# Altium project H743-Feedback.PrjPcb (part 2 of 3)

## Sheet Feedback.SchDoc: Feedback
size Tabloid; DocumentNumber: FB-001; Revision: A; SheetNumber: 3; SheetTotal: 5
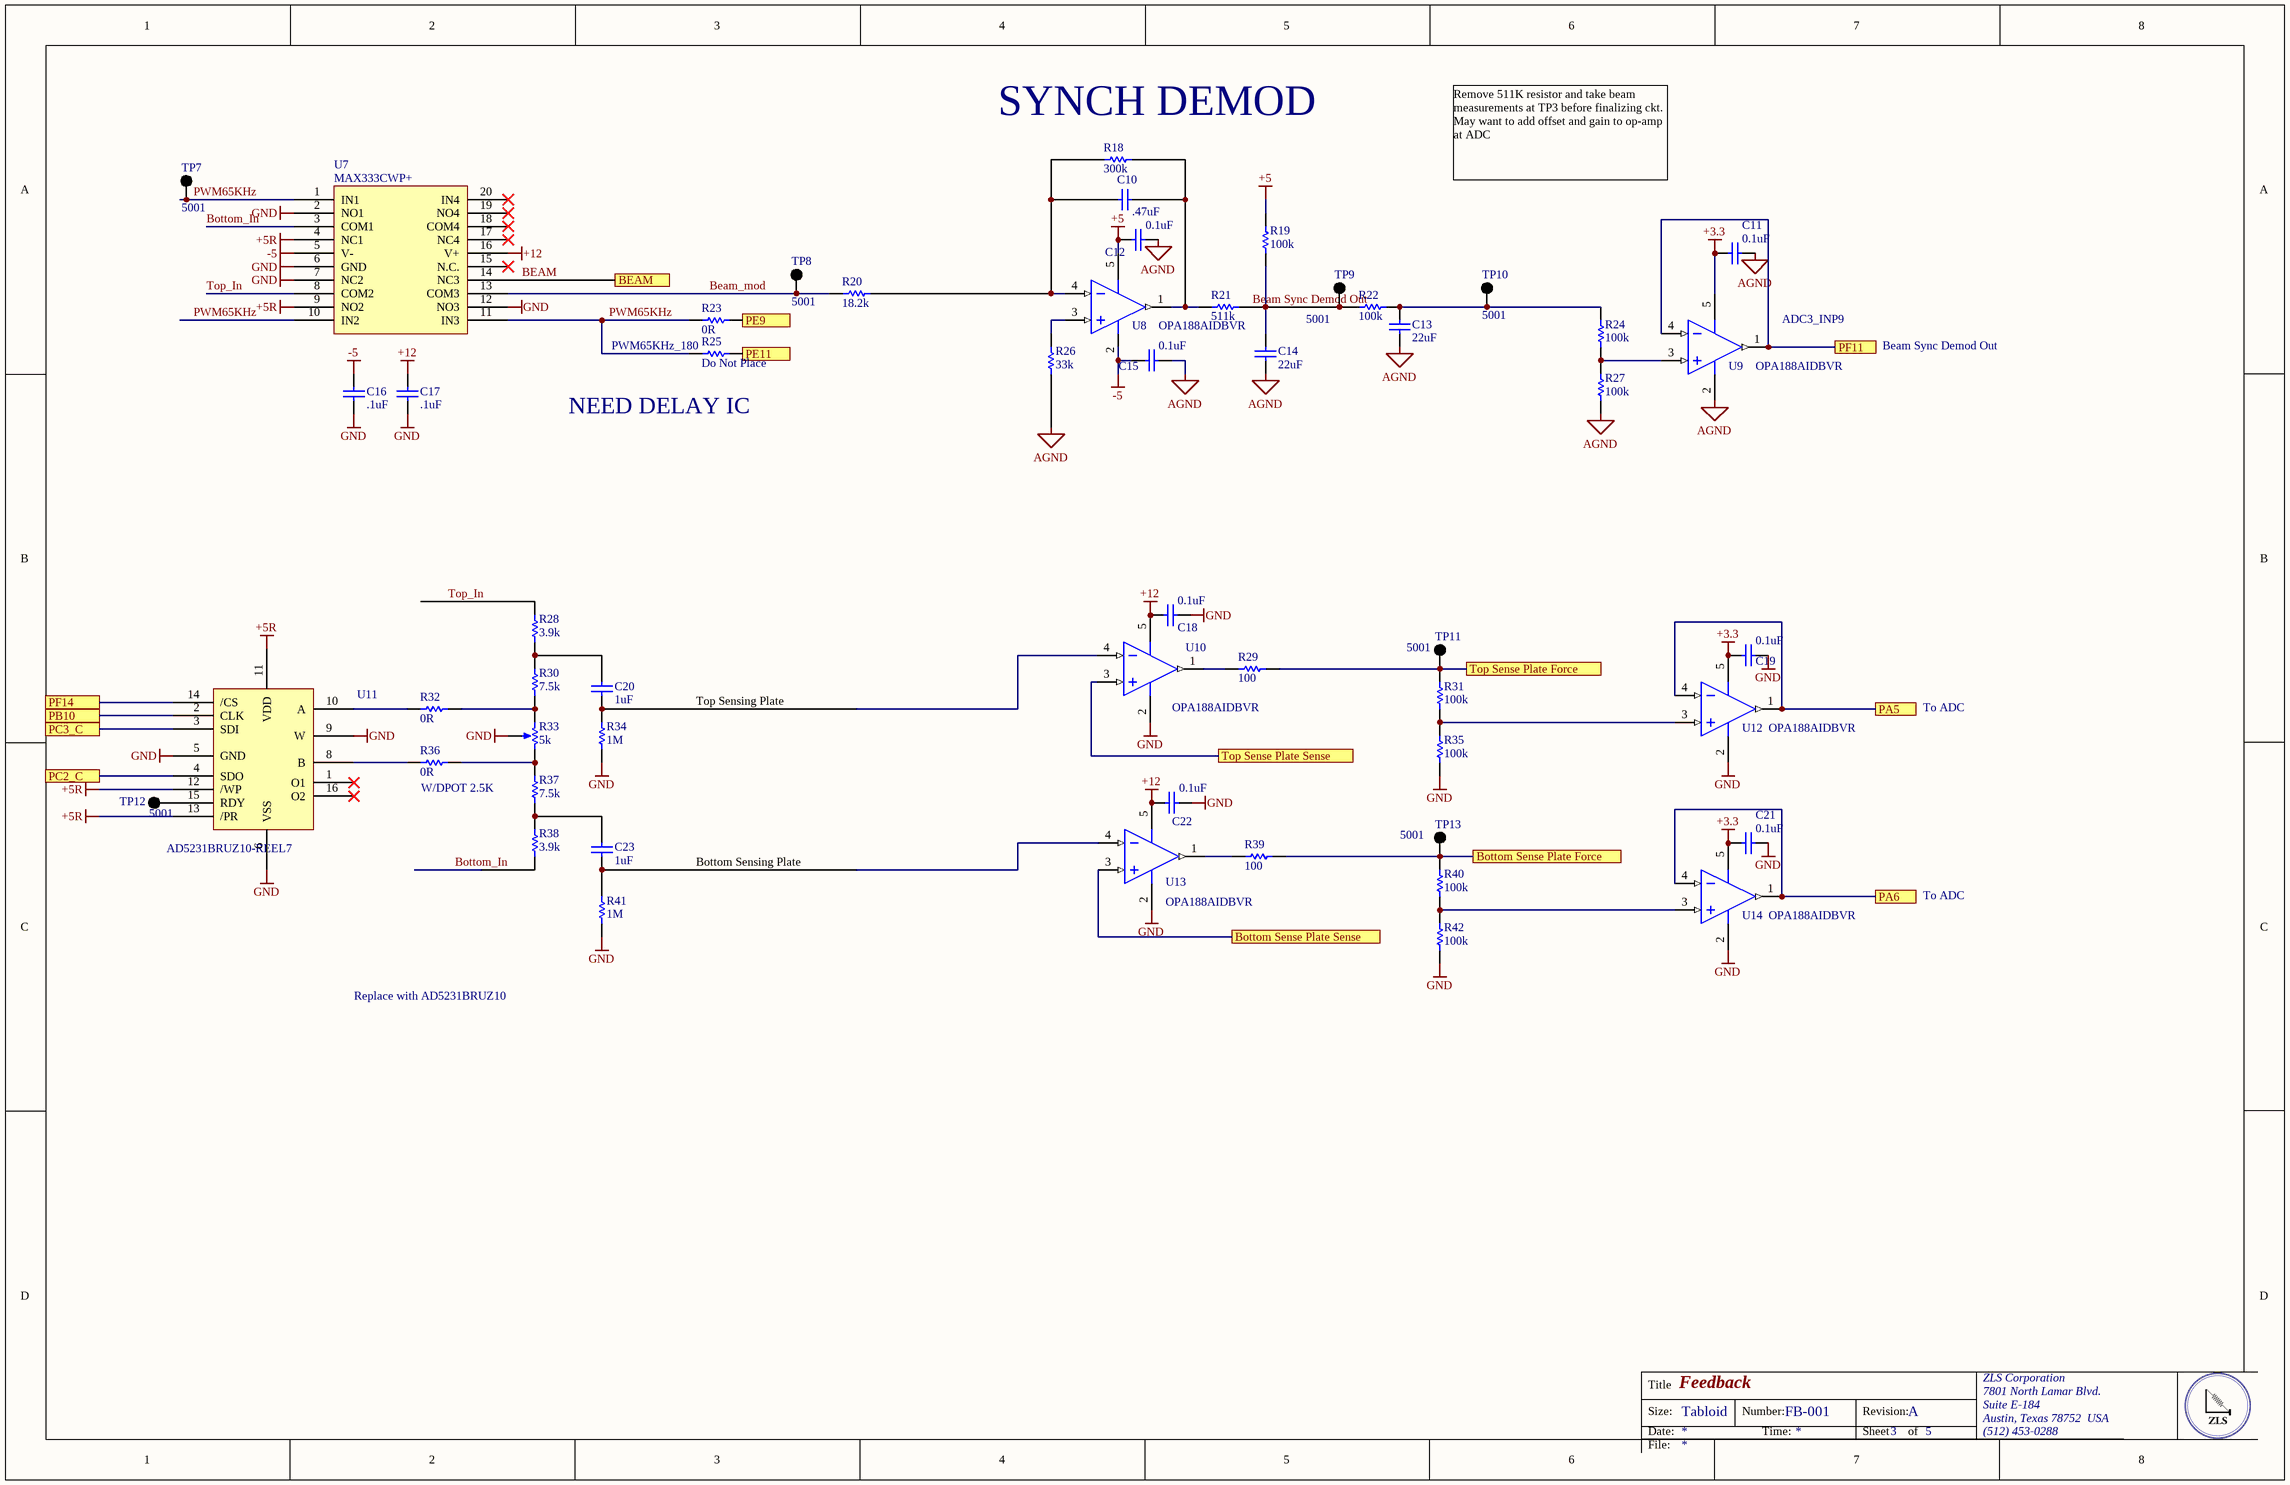
[diagram p2: Feedback.SchDoc]

### Parts
C10  .47uF  [CAPC0805(2012)75_L]
C11  0.1uF  [CAPC0402(1005)60_L]
C12  0.1uF  [CAPC0402(1005)60_L]
C13  22uF  [CAPC0805(2012)75_L]
C14  22uF  [CAPC0805(2012)75_L]
C15  0.1uF  [CAPC0402(1005)60_L]
C16  .1uF  [CAPC0805(2012)75_M]
C17  .1uF  [CAPC0805(2012)75_M]
C18  0.1uF  [CAPC0402(1005)60_L]
C19  0.1uF  [CAPC0402(1005)60_L]
C20  1uF  [CAPC0402(1005)60_L]
C21  0.1uF  [CAPC0402(1005)60_L]
C22  0.1uF  [CAPC0402(1005)60_L]
C23  1uF  [CAPC0402(1005)60_L]
R18  300k  [RESC1005X40X25LL05T05]
R19  100k  [RESC0402(1005)_M]
R20  18.2k  [RESC1005X40X25NL05T05]
R21  511k  [RESC1005X40X25ML05T05]
R22  100k  [RESC0402(1005)_M]
R23  0R  [RESC1005X40X25NL05T10]
R24  100k  [RESC0402(1005)_M]
R25  Do Not Place  [RESC1005X40X25NL05T10]
R26  33k  [RESC0402(1005)_N]
R27  100k  [RESC0402(1005)_M]
R28  3.9k  [RESC1005X40X25NL05T05]
R29  100  [RESC0402(1005)_N]
R30  7.5k  [RESC1005X40X25LL05T05]
R31  100k  [RESC0402(1005)_M]
R32  0R  [RESC1005X40X25NL05T10]
R33  Resistance (Ohms): 5k  [Trimmer 2.54]  (hidden comment: Do Not Place)
R34  1M  [RESC1005X40X25NL05T05]
R35  100k  [RESC0402(1005)_M]
R36  0R  [RESC1005X40X25NL05T10]
R37  7.5k  [RESC1005X40X25LL05T05]
R38  3.9k  [RESC1005X40X25NL05T05]
R39  100  [RESC0402(1005)_N]
R40  100k  [RESC0402(1005)_M]
R41  1M  [RESC1005X40X25NL05T05]
R42  100k  [RESC0402(1005)_M]
TP7  5001  [KSTN-5001]
TP8  5001  [KSTN-5001]
TP9  5001  [KSTN-5001]
TP10  5001  [KSTN-5001]
TP11  5001  [KSTN-5001]
TP12  5001  [KSTN-5001]
TP13  5001  [KSTN-5001]
U7  MAX333CWP+  [TSOP65P640X90-20N]
U8  OPA188AIDBVR  [DBV0005A_M]
U9  OPA188AIDBVR  [DBV0005A_M]
U10  OPA188AIDBVR  [DBV0005A_M]
U11  AD5231BRUZ10-REEL7  [AD5231BRUZ10]
U12  OPA188AIDBVR  [DBV0005A_M]
U13  OPA188AIDBVR  [DBV0005A_M]
U14  OPA188AIDBVR  [DBV0005A_M]

### Ports
BEAM, Bottom Sense Plate Force, Bottom Sense Plate Sense, PA5, PA6, PB10, PC2_C, PC3_C, PE9, PE11, PF11, PF14, Top Sense Plate Force, Top Sense Plate Sense

### Nets
+3.3: C11.2 C19.2 C21.2 U9.5(V+) U12.5(V+) U14.5(V+)
+5: C12.2 R19.2 U8.5(V+)
+5R: U7.4(NC1) U7.9(NO2) U11.11(VDD) U11.12(/WP) U11.13(/PR)
+12: C17.2 C18.2 C22.2 U7.16(V+) U10.5(V+) U13.5(V+)
-5: C15.2 C16.2 U7.5(V-) U8.2(V-)
AGND: C11.1 C12.1 C13.1 C14.1 C15.1 R26.1 R27.1 U9.2(V-)
GND: C16.1 C17.1 C18.1 C19.1 C21.1 C22.1 R33.2(b) R34.1 R35.1 R41.1 R42.1 U7.2(NO1) U7.6(GND) U7.7(NC2) U7.12(NO3) U10.2(V-) U11.5(GND) U11.6(VSS) U11.9(W) U12.2(V-) U13.2(V-) U14.2(V-)
BEAM: U7.14(NC3) ; port BEAM
Beam Sync Demod Out: C14.2 R19.1 R21.2 R22.2 TP9.1
Beam_mod: R20.1 TP8.1 U7.13(COM3)
Bottom Sense Plate Force: R39.2 R40.2 TP13.1 ; port Bottom Sense Plate Force
Bottom Sense Plate Sense: U13.3(IN+) ; port Bottom Sense Plate Sense
Bottom_In: R38.1 U7.3(COM1)
PA5: U12.1(OUT) U12.4(IN-) ; port PA5
PA6: U14.1(OUT) U14.4(IN-) ; port PA6
PB10: U11.2(CLK) ; port PB10
PC2_C: U11.4(SDO) ; port PC2_C
PC3_C: U11.3(SDI) ; port PC3_C
PE9: R23.2 ; port PE9
PE11: R25.2 ; port PE11
PF11: U9.1(OUT) U9.4(IN-) ; port PF11
PF14: U11.14(/CS) ; port PF14
PWM65KHz: R23.1 R25.1 TP7.1 U7.1(IN1) U7.10(IN2) U7.11(IN3)
Top Sense Plate Force: R29.2 R31.2 TP11.1 ; port Top Sense Plate Force
Top Sense Plate Sense: U10.3(IN+) ; port Top Sense Plate Sense
Top_In: R28.2 U7.8(COM2)
NetC10_1: C10.1 R18.1 R20.2 U8.4(IN-)
NetC10_2: C10.2 R18.2 R21.1 U8.1(OUT)
NetC13_2: C13.2 R22.1 R24.2 TP10.1
NetC20_1: C20.1 R34.2 U10.4(IN-)
NetC20_2: C20.2 R28.1 R30.2
NetC23_1: C23.1 R41.2 U13.4(IN-)
NetC23_2: C23.2 R37.1 R38.2
NetR24_1: R24.1 R27.2 U9.3(IN+)
NetR26_2: R26.2 U8.3(IN+)
NetR29_1: R29.1 U10.1(OUT)
NetR30_1: R30.1 R32.2 R33.1(a)
NetR31_1: R31.1 R35.2 U12.3(IN+)
NetR32_1: R32.1 U11.10(A)
NetR33_3: R33.3(c) R36.2 R37.2
NetR36_1: R36.1 U11.8(B)
NetR39_1: R39.1 U13.1(OUT)
NetR40_1: R40.1 R42.2 U14.3(IN+)
NetTP12_1: TP12.1 U11.15(RDY)

Not connected (* = marked no-connect by the designer): U7 15(N.C.)* 17(NC4)* 18(COM4)* 19(NO4)* 20(IN4)*; U11 1(O1)* 16(O2)*

### Notes on the sheet
- (near R18) SYNCH DEMOD
- Remove 511K resistor and take beam measurements at TP3 before finalizing ckt.
  May want to add offset and gain to op-amp at ADC
- PWM65KHz_180
- (near U9) ADC3_INP9
- Beam Sync Demod Out
- (near R25) NEED DELAY IC
- Top Sensing Plate
- To ADC
- (near R36) W/DPOT 2.5K
- Bottom Sensing Plate
- Replace with AD5231BRUZ10
- Title
- Size:
- Date:
- Tabloid
- Number:
- Time:
- Revision:
- Sheet
- of
- ZLS Corporation
- 7801 North Lamar Blvd.
- Suite E-184
- Austin, Texas 78752  USA
- (512) 453-0288
- File:

### Library data of the parts
C10 = CMP-1036-02117-1: 0.47µF ±10% 16V Ceramic Capacitor X7R 0805 (2012 Metric); Manufacturer: Samsung; Manufacturer Part Number: CL21B474KOFNNNE; Capacitance: 470nF; Supplier 1: Future Electronics; Supplier Part Number 1: CL21B474KOFNNNE-CUTT; Stock 1: 1990; Pricing 1: 1=0.0399, 50=0.0138, 100=0.0114, 250=0.0089, 500=0.0074 (USD); Mount: Surface Mount; Case/Package: 0805; Case Code (Metric): 2012; Case Code (Imperial): 0805; Contact Plating: Tin; Min Operating Temperature: -55°C; Max Operating Temperature: 125°C; Tolerance: 10%; Dielectric: X7R; Packaging: Tape and Reel; Voltage Rating: 16V; Package Quantity: 2000; Voltage Rating (DC): 16V; Length: 2mm; Height: 1.25mm; Width: 0.049inch; Thickness: 0.053inch; Depth: 1.25mm; Radiation Hardening: No; Lead Free: Lead Free; ComponentLink1URL: https://www.verical.com/server-webapp/html/getDatasheet?partID=482152&src-supplier=Verical; ComponentLink1Description: https://www.verical.com/server-webapp/html/getDatasheet?partID=482152&src-supplier=Verical
C11 C12 C15 C18 C19 C21 C22 = CMP-1034-00252-1: CAP CER 0.1UF 10V X7R 0402; Manufacturer: Murata Electronics North America; Manufacturer Part Number: GRM155R71A104KA01D; Tolerance: ±10%; Supplier 1: Digi-Key; Supplier Part Number 1: 490-6321-1-ND; RoHS: RoHS Compliant; Category: Capacitors; Stock 1: 2920395; Pricing 1: 1=0.1, 10=0.014, 100=0.0063, 500=0.00446, 1000=0.00351, 2500=0.00319, 5000=0.00293 (USD); Packaging: Cut Tape (CT); Part Status: Active; Voltage - Rated: 10V; Temperature Coefficient: X7R; Operating Temperature: -55°C ~ 125°C; Features: -; Ratings: -; Applications: General Purpose; Mounting Type: Surface Mount, MLCC; Package / Case: 0402 (1005 Metric); Size / Dimension: 0.039" L x 0.020" W (1.00mm x 0.50mm); Height - Seated (Max): -; Thickness (Max): 0.022" (0.55mm); Lead Spacing: -; ComponentLink1URL: http://www.murata.com/~/media/webrenewal/support/library/catalog/products/capacitor/mlcc/c02e.ashx?la=en-us; ComponentLink1Description: http://www.murata.com/~/media/webrenewal/support/library/catalog/products/capacitor/mlcc/c02e.ashx?la=en-us
C13 C14 = CMP-1036-02117-1: 22µF ±20% 16V Ceramic Capacitor X5R 0805 (2012 Metric); Manufacturer: Samsung; Manufacturer Part Number: CL21A226MOCLRNC; Supplier 1: Arrow; Supplier Part Number 1: CL21A226MOCLRNC; Stock 1: 62995; Pricing 1: 1=0.3133, 10=0.2183, 25=0.2161, 100=0.1168, 250=0.1155, 500=0.0858, 1000=0.0716, 3000=0.0709, 6000=0.0594, 15000=0.0527, 30000=0.0522 (USD); Mount: Surface Mount; Case/Package: 0805; Case Code (Metric): 2012; Case Code (Imperial): 0805; Min Operating Temperature: -55°C; Max Operating Temperature: 85°C; Packaging: Tape and Reel; Capacitance: 22uF; Voltage Rating: 16V; Tolerance: 20%; Length: 0.079inch; Width: 0.049inch; Thickness: 0.037inch; ComponentLink1URL: http://www.samsungsem.com/kr/support/product-search/mlcc/CL21A226MOCLRNC.jsp?src-supplier=Digi-Key; ComponentLink1Description: http://www.samsungsem.com/kr/support/product-search/mlcc/CL21A226MOCLRNC.jsp?src-supplier=Digi-Key
C16 C17 = CMP-1036-01414-1: 0.1µF ±10% 16V Ceramic Capacitor X7R 0805 (2012 Metric); Manufacturer: Yageo; Manufacturer Part Number: CC0805KRX7R7BB104; Capacitance: 100nF; Insulation Resistance: 100GR; Supplier 1: Future Electronics; Supplier Part Number 1: CC0805KRX7R7BB104-CUTT; Stock 1: 160; Pricing 1: 1=0.0364, 100=0.0181, 250=0.0158, 500=0.0142, 1500=0.012 (USD); Mount: Surface Mount; Case/Package: 0805; Number of Pins: 2; Case Code (Metric): 2012; Case Code (Imperial): 0805; Min Operating Temperature: -55°C; Max Operating Temperature: 125°C; Tolerance: 10%; Dielectric: X7R; Voltage Rating: 16V; Voltage Rating (DC): 16V; Packaging: Tape and Reel; Package Quantity: 1; Termination: SMD/SMT; Composition: Ceramic; Voltage: 16V; Length: 2mm; Height: 0.85mm; Depth: 1.25mm; Width: 0.049inch; Thickness: 0.033inch; Radiation Hardening: No; REACH SVHC: No SVHC; Lead Free: Lead Free; Halogen Free: Halogen Free; ComponentLink1URL: http://www.farnell.com/datasheets/1784427.pdf?src-supplier=Element14; ComponentLink1Description: http://www.farnell.com/datasheets/1784427.pdf?src-supplier=Element14; ComponentLink2URL: https://www.verical.com/server-webapp/html/getDatasheet?partID=314877&src-supplier=Verical; ComponentLink2Description: https://www.verical.com/server-webapp/html/getDatasheet?partID=314877&src-supplier=Verical; ComponentLink3URL: http://www.yageo.com/documents/recent/UPY-GPHC_X7R_6.3V-to-50V_18.pdf?src-supplier=Digi-Key; ComponentLink3Description: http://www.yageo.com/documents/recent/UPY-GPHC_X7R_6.3V-to-50V_18.pdf?src-supplier=Digi-Key; ComponentLink4URL: http://www.yageo.com/documents/recent/UPY-GPHC_X7R_6.3V-to-50V_8.pdf?src-supplier=Avnet; ComponentLink4Description: http://www.yageo.com/documents/recent/UPY-GPHC_X7R_6.3V-to-50V_8.pdf?src-supplier=Avnet; ComponentLink5URL: http://www.yageo.com/documents/recent/UPY-GPHC_X7R_6.3V-to-50V_8.pdf?src-supplier=Avnet+Europe; ComponentLink5Description: http://www.yageo.com/documents/recent/UPY-GPHC_X7R_6.3V-to-50V_8.pdf?src-supplier=Avnet+Europe; ComponentLink6URL: http://www.farnell.com/datasheets/1489800.pdf?src-supplier=Element14; ComponentLink6Description: http://www.farnell.com/datasheets/1489800.pdf?src-supplier=Element14
C20 C23 = CMP-1034-00252-1: 1µF ±10% 16V Ceramic Capacitor X5R 0402 (1005 Metric); Manufacturer: Samsung; Manufacturer Part Number: CL05A105KO5NNNC; Supplier 1: Future Electronics; Supplier Part Number 1: CL05A105KO5NNNC-CUTT; Stock 1: 8167; Pricing 1: 1=0.0074, 500=0.0064, 1500=0.0062, 2500=0.0061, 5000=0.006 (USD); Mount: Surface Mount; Case/Package: 0402; Case Code (Metric): 1005; Case Code (Imperial): 0402; Contact Plating: Tin; Min Operating Temperature: -55°C; Max Operating Temperature: 85°C; Tolerance: 10%; Capacitance: 1uF; Dielectric: X5R; Packaging: Tape and Reel; Package Quantity: 1; Voltage Rating: 16V; Voltage: 16V; Length: 1mm; Height: 0.5mm; Width: 0.02inch; Thickness: 0.022inch; Depth: 0.5mm; Radiation Hardening: No; ComponentLink1URL: http://www1.futureelectronics.com/doc/SAMSUNG/CL05A105KO5NNNC.pdf?src-supplier=Future+Electronics; ComponentLink1Description: http://www1.futureelectronics.com/doc/SAMSUNG/CL05A105KO5NNNC.pdf?src-supplier=Future+Electronics; ComponentLink2URL: https://www.verical.com/server-webapp/html/getDatasheet?partID=355272&src-supplier=Verical; ComponentLink2Description: https://www.verical.com/server-webapp/html/getDatasheet?partID=355272&src-supplier=Verical
R18 = CMP-2002-08495-1: RES SMD 300K OHM 1% 1/16W 0402; Manufacturer: Vishay Dale; Part Number: CRCW0402300KFKED; Resistance: 300kR; Temperature Coefficient: 100ppm/°C; Power Rating: 63mW; Voltage Rating: 50V; Supplier 1: Digi-Key; Supplier Part Number 1: 541-300KLCT-ND; Manufacturer Part Number: CRCW0402300KFKED; Stock 1: 11486; Pricing 1: 1=0.10000, 10=0.03800, 100=0.01540, 1000=0.00690, 2500=0.00599, 5000=0.00495 (USD); RoHS: Yes; Mount: Surface Mount; Case/Package: 0402; Number of Pins: 2; Weight: 2.3E-05oz; Case Code (Metric): 1005; Case Code (Imperial): 0402; Contact Plating: Tin; Min Operating Temperature: -55°C; Max Operating Temperature: 155°C; Tolerance: 1%; Packaging: Tape and Reel; Composition: Thick Film; Package Quantity: 10; Termination: SMD/SMT; Voltage Rating (DC): 50V; Number of Terminations: 2; Max Power Dissipation: 63mW; Features: Automotive AEC-Q200; Military Standard: Not; Length: 1mm; Height: 0.35mm; Width: 0.02inch; Depth: 0.5mm; Radiation Hardening: No; Lead Free: Lead Free; REACH SVHC: Unknown; ComponentLink1URL: https://datasheet.ciiva.com/11810/0900766b80d98824-11810173.pdf?src-supplier=RSComponents; ComponentLink1Description: https://datasheet.ciiva.com/11810/0900766b80d98824-11810173.pdf?src-supplier=RSComponents; ComponentLink2URL: https://datasheet.ciiva.com/22675/1912744-22675557.pdf?src-supplier=Element14; ComponentLink2Description: https://datasheet.ciiva.com/22675/1912744-22675557.pdf?src-supplier=Element14; ComponentLink3URL: https://datasheet.ciiva.com/2463/dcrcwe3-2463577.pdf?src-supplier=Digi-Key; ComponentLink3Description: https://datasheet.ciiva.com/2463/dcrcwe3-2463577.pdf?src-supplier=Digi-Key; ComponentLink4URL: https://datasheet.ciiva.com/2463/dcrcwe3-2463578.pdf?src-supplier=Digi-Key; ComponentLink4Description: https://datasheet.ciiva.com/2463/dcrcwe3-2463578.pdf?src-supplier=Digi-Key; ComponentLink5URL: https://datasheet.ciiva.com/8948/dcrcwe3-8948938.pdf?src-supplier=Avnet; ComponentLink5Description: https://datasheet.ciiva.com/8948/dcrcwe3-8948938.pdf?src-supplier=Avnet; ComponentLink6URL: https://datasheet.ciiva.com/16886/dcrcwe3-16886218.pdf?src-supplier=Avnet+Europe; ComponentLink6Description: https://datasheet.ciiva.com/16886/dcrcwe3-16886218.pdf?src-supplier=Avnet+Europe; ComponentLink7URL: https://datasheet.ciiva.com/2463/dcrcwe3-2463579.pdf?src-supplier=Digi-Key; ComponentLink7Description: https://datasheet.ciiva.com/2463/dcrcwe3-2463579.pdf?src-supplier=Digi-Key; ComponentLink8URL: https://datasheet.ciiva.com/7674/1697337-7674011.pdf?src-supplier=Element14; ComponentLink8Description: https://datasheet.ciiva.com/7674/1697337-7674011.pdf?src-supplier=Element14; ComponentLink9URL: https://datasheet.ciiva.com/7674/1697337-7674012.pdf?src-supplier=Element14; ComponentLink9Description: https://datasheet.ciiva.com/7674/1697337-7674012.pdf?src-supplier=Element14; ComponentLink10URL: https://datasheet.ciiva.com/16396/dcrcwe3-16396924.pdf?src-supplier=Future+Electronics; ComponentLink10Description: https://datasheet.ciiva.com/16396/dcrcwe3-16396924.pdf?src-supplier=Future+Electronics; ComponentLink11URL: https://datasheet.ciiva.com/5551/dcrcwe3-109170-5551389.pdf?src-supplier=Mouser; ComponentLink11Description: https://datasheet.ciiva.com/5551/dcrcwe3-109170-5551389.pdf?src-supplier=Mouser; ComponentLink12URL: https://datasheet.ciiva.com/22708/1697337-22708046.pdf?src-supplier=Element14; ComponentLink12Description: https://datasheet.ciiva.com/22708/1697337-22708046.pdf?src-supplier=Element14
R19 R22 R24 R27 R31 R35 R40 R42 = CMP-1011-00940-1: 100k 0.063W 1% 0402 (1005 Metric)  SMD; Manufacturer: Panasonic; Manufacturer Part Number: ERJ-2RKF1003X; Resistance: 100kR; Power Rating: 100mW; Temperature Coefficient: 100ppm/°C; Voltage Rating: 50V; Supplier 1: Digi-Key; Supplier Part Number 1: P100KLCT-ND; Stock 1: 9533476; Pricing 1: 1=0.10000, 10=0.04500, 100=0.01830, 1000=0.00823, 2500=0.00715, 5000=0.00590 (USD); RoHS: Yes; Mount: Surface Mount; Case/Package: 0402; Number of Pins: 2; Case Code (Imperial): 0402; Case Code (Metric): 1005; Contact Plating: Tin; Min Operating Temperature: -55°C; Max Operating Temperature: 155°C; Tolerance: 1%; Packaging: Tape and Reel; Composition: Thick Film; Voltage Rating (DC): 50V; Termination: SMD/SMT; Military Standard: Not; Package Quantity: 1; Number of Terminations: 2; Max Power Dissipation: 100mW; Features: Automotive AEC-Q200; Length: 1mm; Height: 0.35mm; Width: 0.5mm; Depth: 0.5mm; Radiation Hardening: No; Lead Free: Lead Free; REACH SVHC: No SVHC; ComponentLink1URL: https://datasheet.ciiva.com/11821/0900766b80f80784-11821175.pdf?src-supplier=RSComponents; ComponentLink1Description: https://datasheet.ciiva.com/11821/0900766b80f80784-11821175.pdf?src-supplier=RSComponents; ComponentLink2URL: https://datasheet.ciiva.com/34303/1987038-34303550.pdf?src-supplier=Jameco; ComponentLink2Description: https://datasheet.ciiva.com/34303/1987038-34303550.pdf?src-supplier=Jameco; ComponentLink3URL: https://datasheet.ciiva.com/7830/aoa0000ce2-7830725.pdf?src-supplier=Element14; ComponentLink3Description: https://datasheet.ciiva.com/7830/aoa0000ce2-7830725.pdf?src-supplier=Element14; ComponentLink4URL: https://datasheet.ciiva.com/16522/aoa0000ce2-16522647.pdf?src-supplier=Avnet+Asia; ComponentLink4Description: https://datasheet.ciiva.com/16522/aoa0000ce2-16522647.pdf?src-supplier=Avnet+Asia; ComponentLink5URL: https://datasheet.ciiva.com/16778/70260748-16778055.pdf?src-supplier=Allied+Electronics; ComponentLink5Description: https://datasheet.ciiva.com/16778/70260748-16778055.pdf?src-supplier=Allied+Electronics; ComponentLink6URL: https://datasheet.ciiva.com/43467/1678782-43467480.pdf?src-supplier=Farnell; ComponentLink6Description: https://datasheet.ciiva.com/43467/1678782-43467480.pdf?src-supplier=Farnell; ComponentLink7URL: https://datasheet.ciiva.com/16440/aoa0000ce2-16440217.pdf?src-supplier=Future+Electronics; ComponentLink7Description: https://datasheet.ciiva.com/16440/aoa0000ce2-16440217.pdf?src-supplier=Future+Electronics; ComponentLink8URL: https://datasheet.ciiva.com/30245/aoa0000ce2-30245691.pdf?src-supplier=Onlinecomponents.com; ComponentLink8Description: https://datasheet.ciiva.com/30245/aoa0000ce2-30245691.pdf?src-supplier=Onlinecomponents.com; ComponentLink9URL: https://datasheet.ciiva.com/7830/426256-7830974.pdf?src-supplier=Element14; ComponentLink9Description: https://datasheet.ciiva.com/7830/426256-7830974.pdf?src-supplier=Element14; ComponentLink10URL: https://datasheet.ciiva.com/16784/70260748-16784190.pdf?src-supplier=Allied+Electronics; ComponentLink10Description: https://datasheet.ciiva.com/16784/70260748-16784190.pdf?src-supplier=Allied+Electronics; ComponentLink11URL: https://datasheet.ciiva.com/22723/426256-22723902.pdf?src-supplier=Element14; ComponentLink11Description: https://datasheet.ciiva.com/22723/426256-22723902.pdf?src-supplier=Element14; ComponentLink12URL: https://datasheet.ciiva.com/48531/aoa0000ce2-48531070.pdf?src-supplier=Avnet; ComponentLink12Description: https://datasheet.ciiva.com/48531/aoa0000ce2-48531070.pdf?src-supplier=Avnet; ComponentLink13URL: https://datasheet.ciiva.com/9186/aoa0000ce2-9186687.pdf?src-supplier=Avnet; ComponentLink13Description: https://datasheet.ciiva.com/9186/aoa0000ce2-9186687.pdf?src-supplier=Avnet
R20 = CMP-2002-08262-1: RES SMD 18.2K OHM 1% 1/16W 0402; Manufacturer: Vishay Dale; Part Number: CRCW040218K2FKED; Resistance: 18.2kR; Temperature Coefficient: 100ppm/°C; Power Rating: 63mW; Voltage Rating (DC): 50V; Supplier 1: Newark; Supplier Part Number 1: 42K3422; Manufacturer Part Number: CRCW040218K2FKED; Stock 1: 40000; Pricing 1: 10000=0.00300 (USD); RoHS: Yes; Mount: Surface Mount; Case/Package: 0402; Number of Pins: 2; Weight: 2.3E-05oz; Contact Plating: Tin; Case Code (Metric): 1005; Case Code (Imperial): 0402; Min Operating Temperature: -55°C; Max Operating Temperature: 155°C; Tolerance: 1%; Composition: Thick Film; Packaging: Tape and Reel; Number of Terminations: 2; Max Power Dissipation: 63mW; Features: Automotive AEC-Q200; Voltage Rating: 50V; Package Quantity: 10; Termination: SMD/SMT; Military Standard: Not; Length: 1mm; Height: 0.35mm; Width: 0.02inch; Depth: 0.5mm; Radiation Hardening: No; Lead Free: Lead Free; REACH SVHC: Unknown; ComponentLink1URL: https://datasheet.ciiva.com/11818/0900766b80d98824-11818009.pdf?src-supplier=RSComponents; ComponentLink1Description: https://datasheet.ciiva.com/11818/0900766b80d98824-11818009.pdf?src-supplier=RSComponents; ComponentLink2URL: https://datasheet.ciiva.com/2464/dcrcwe3-2464072.pdf?src-supplier=Digi-Key; ComponentLink2Description: https://datasheet.ciiva.com/2464/dcrcwe3-2464072.pdf?src-supplier=Digi-Key; ComponentLink3URL: https://datasheet.ciiva.com/7663/1697337-7663848.pdf?src-supplier=Element14; ComponentLink3Description: https://datasheet.ciiva.com/7663/1697337-7663848.pdf?src-supplier=Element14; ComponentLink4URL: https://datasheet.ciiva.com/2464/dcrcwe3-2464073.pdf?src-supplier=Digi-Key; ComponentLink4Description: https://datasheet.ciiva.com/2464/dcrcwe3-2464073.pdf?src-supplier=Digi-Key; ComponentLink5URL: https://datasheet.ciiva.com/2464/dcrcwe3-2464074.pdf?src-supplier=Digi-Key; ComponentLink5Description: https://datasheet.ciiva.com/2464/dcrcwe3-2464074.pdf?src-supplier=Digi-Key; ComponentLink6URL: https://datasheet.ciiva.com/7664/1533075-7664058.pdf?src-supplier=Element14; ComponentLink6Description: https://datasheet.ciiva.com/7664/1533075-7664058.pdf?src-supplier=Element14; ComponentLink7URL: https://datasheet.ciiva.com/3256/dcrcwe3-3256123.pdf?src-supplier=Avnet; ComponentLink7Description: https://datasheet.ciiva.com/3256/dcrcwe3-3256123.pdf?src-supplier=Avnet; ComponentLink8URL: https://datasheet.ciiva.com/16758/70201119-16758827.pdf?src-supplier=Allied+Electronics; ComponentLink8Description: https://datasheet.ciiva.com/16758/70201119-16758827.pdf?src-supplier=Allied+Electronics; ComponentLink9URL: https://datasheet.ciiva.com/5546/dcrcwe3-109170-5546268.pdf?src-supplier=Mouser; ComponentLink9Description: https://datasheet.ciiva.com/5546/dcrcwe3-109170-5546268.pdf?src-supplier=Mouser
R21 = CMP-2002-00976-1: RES SMD 511K OHM 1% 1/10W 0402; Part Number: ERJ-2RKF5113X; Manufacturer: Panasonic; Resistance: 511kR; Power Rating: 100mW; Temperature Coefficient: 100ppm/°C; Voltage Rating: 50V; Supplier 1: Digi-Key; Supplier Part Number 1: P511KLCT-ND; Manufacturer Part Number: ERJ-2RKF5113X; Stock 1: 81040; Pricing 1: 1=0.10000, 10=0.04500, 100=0.01830, 1000=0.00823, 2500=0.00715, 5000=0.00590 (USD); RoHS: Yes; Mount: Surface Mount; Case/Package: 0402; Weight: 2.8E-05oz; Case Code (Metric): 1005; Case Code (Imperial): 0402; Contact Plating: Tin; Min Operating Temperature: -55°C; Max Operating Temperature: 155°C; Tolerance: 1%; Packaging: Tape and Reel; Composition: Thick Film; Package Quantity: 10000; Termination: SMD/SMT; Voltage Rating (DC): 50V; Number of Terminations: 2; Max Power Dissipation: 100mW; Military Standard: Not; Length: 1mm; Height: 0.35mm; Width: 0.5mm; Depth: 0.5mm; Radiation Hardening: No; Lead Free: Lead Free; REACH SVHC: Yes; ComponentLink1URL: https://datasheet.ciiva.com/46373/1678782-46373125.pdf?src-supplier=Element14; ComponentLink1Description: https://datasheet.ciiva.com/46373/1678782-46373125.pdf?src-supplier=Element14; ComponentLink2URL: https://datasheet.ciiva.com/30263/aoa0000ce2-30263657.pdf?src-supplier=Onlinecomponents.com; ComponentLink2Description: https://datasheet.ciiva.com/30263/aoa0000ce2-30263657.pdf?src-supplier=Onlinecomponents.com; ComponentLink3URL: https://datasheet.ciiva.com/22721/1678782-22721548.pdf?src-supplier=Farnell; ComponentLink3Description: https://datasheet.ciiva.com/22721/1678782-22721548.pdf?src-supplier=Farnell; ComponentLink4URL: https://datasheet.ciiva.com/9181/aoa0000ce2-9181373.pdf?src-supplier=Avnet; ComponentLink4Description: https://datasheet.ciiva.com/9181/aoa0000ce2-9181373.pdf?src-supplier=Avnet; ComponentLink5URL: https://datasheet.ciiva.com/43467/1678782-43467549.pdf?src-supplier=Farnell; ComponentLink5Description: https://datasheet.ciiva.com/43467/1678782-43467549.pdf?src-supplier=Farnell; ComponentLink6URL: https://datasheet.ciiva.com/24164/aoa0000ce2-24164470.pdf?src-supplier=Mouser; ComponentLink6Description: https://datasheet.ciiva.com/24164/aoa0000ce2-24164470.pdf?src-supplier=Mouser
R23 R25 R32 R36 = CMP-2002-07912-1: RES SMD 0 OHM JUMPER 1/16W 0402; Manufacturer: Yageo / Phycomp; Part Number: RC0402JR-070RL; Resistance: 0mR; Voltage Rating: 50V; Temperature Coefficient: 200ppm/°C; Tolerance: 5%; Power Rating: 62.5mW; Max Power Dissipation: 63mW; Supplier 1: Digi-Key; Supplier Part Number 1: 311-0.0JRCT-ND; Manufacturer Part Number: RC0402JR-070RL; Stock 1: 75833567; Pricing 1: 1=0.10000, 10=0.01500, 25=0.01080, 50=0.00800, 100=0.00600, 250=0.00456, 500=0.00364, 1000=0.00268, 5000=0.00192 (USD); RoHS: Yes; Case/Package: 0402; Case Code (Metric): 1005; Case Code (Imperial): 0402; Contact Plating: Tin,Matte; Min Operating Temperature: -55°C; Max Operating Temperature: 155°C; Packaging: Tape and Reel; Termination: SMD/SMT; Military Standard: Not; Package Quantity: 1; Composition: Thick Film; Number of Terminations: 2; Features: Moisture Resistant; Length: 1mm; Height: 0.016inch; Width: 0.02inch; Depth: 0.5mm; Radiation Hardening: No; REACH SVHC: Unknown; Lead Free: Lead Free; ComponentLink1URL: https://datasheet.ciiva.com/2452/pyu-rc0402-51-rohs-l-6-2452608.pdf?src-supplier=Digi-Key; ComponentLink1Description: https://datasheet.ciiva.com/2452/pyu-rc0402-51-rohs-l-6-2452608.pdf?src-supplier=Digi-Key; ComponentLink2URL: https://datasheet.ciiva.com/11808/0900766b80c66297-11808195.pdf?src-supplier=RSComponents; ComponentLink2Description: https://datasheet.ciiva.com/11808/0900766b80c66297-11808195.pdf?src-supplier=RSComponents; ComponentLink3URL: https://datasheet.ciiva.com/8896/pyu-rc0402-51-rohs-l-6-8896201.pdf?src-supplier=Avnet; ComponentLink3Description: https://datasheet.ciiva.com/8896/pyu-rc0402-51-rohs-l-6-8896201.pdf?src-supplier=Avnet; ComponentLink4URL: https://datasheet.ciiva.com/28386/pyu-rc0402-51-rohs-l-6-28386633.pdf?src-supplier=Avnet+Europe; ComponentLink4Description: https://datasheet.ciiva.com/28386/pyu-rc0402-51-rohs-l-6-28386633.pdf?src-supplier=Avnet+Europe; ComponentLink5URL: https://datasheet.ciiva.com/7983/1018594-7983535.pdf?src-supplier=Element14; ComponentLink5Description: https://datasheet.ciiva.com/7983/1018594-7983535.pdf?src-supplier=Element14; ComponentLink6URL: https://datasheet.ciiva.com/2452/pyu-r-int-thick-7-2452609.pdf?src-supplier=Digi-Key; ComponentLink6Description: https://datasheet.ciiva.com/2452/pyu-r-int-thick-7-2452609.pdf?src-supplier=Digi-Key; ComponentLink7URL: https://datasheet.ciiva.com/2452/pyu-r-int-thick-7-2452610.pdf?src-supplier=Digi-Key; ComponentLink7Description: https://datasheet.ciiva.com/2452/pyu-r-int-thick-7-2452610.pdf?src-supplier=Digi-Key; ComponentLink8URL: https://datasheet.ciiva.com/22747/1018594-22747515.pdf?src-supplier=Element14; ComponentLink8Description: https://datasheet.ciiva.com/22747/1018594-22747515.pdf?src-supplier=Element14; ComponentLink9URL: https://datasheet.ciiva.com/15189/getdatasheetpartid-326379-15189533.pdf?src-supplier=Verical; ComponentLink9Description: https://datasheet.ciiva.com/15189/getdatasheetpartid-326379-15189533.pdf?src-supplier=Verical
R26 = CMP-1011-00680-1: RES SMD 33K OHM 1% 1/16W 0402; Manufacturer: Vishay; Manufacturer Part Number: CRCW040233K0FKED; Power: 0.063 W; Value: 33000.00 Ohm; Case-EIA: 0402; Case-Metric: 1005; Resistance: 33kR; Temperature Coefficient: 100ppm/°C; Power Rating: 63mW; Voltage Rating (DC): 50V; Tolerance: 1 %; Technology: SMT; Supplier 1: Future Electronics; Supplier Part Number 1: CRCW040233K0FKED-CUTT; Stock 1: 548; Pricing 1: 1=0.00710, 500=0.00660, 1500=0.00610, 2500=0.00570, 5000=0.00530 (USD); RoHS: Yes; Mount: Surface Mount; Case/Package: 0402; Number of Pins: 2; Weight: 2.3E-05oz; Case Code (Imperial): 0402; Case Code (Metric): 1005; Contact Plating: Tin; Min Operating Temperature: -55°C; Max Operating Temperature: 155°C; Composition: Thick Film; Packaging: Tape and Reel; Voltage Rating: 50V; Number of Terminations: 2; Max Power Dissipation: 63mW; Package Quantity: 10; Termination: SMD/SMT; Features: Automotive AEC-Q200; Military Standard: Not; Length: 1mm; Height: 0.35mm; Width: 0.5mm; Depth: 0.5mm; Radiation Hardening: No; Lead Free: Lead Free; REACH SVHC: Unknown; ComponentLink1URL: https://datasheet.ciiva.com/11812/0900766b80d98824-11812191.pdf?src-supplier=RSComponents; ComponentLink1Description: https://datasheet.ciiva.com/11812/0900766b80d98824-11812191.pdf?src-supplier=RSComponents; ComponentLink2URL: https://datasheet.ciiva.com/5544/dcrcwe3-109170-5544613.pdf?src-supplier=Mouser; ComponentLink2Description: https://datasheet.ciiva.com/5544/dcrcwe3-109170-5544613.pdf?src-supplier=Mouser; ComponentLink3URL: https://datasheet.ciiva.com/22674/1847332-22674693.pdf?src-supplier=Element14; ComponentLink3Description: https://datasheet.ciiva.com/22674/1847332-22674693.pdf?src-supplier=Element14; ComponentLink4URL: https://datasheet.ciiva.com/16200/dcrcwe3-16200566.pdf?src-supplier=Future+Electronics; ComponentLink4Description: https://datasheet.ciiva.com/16200/dcrcwe3-16200566.pdf?src-supplier=Future+Electronics; ComponentLink5URL: https://datasheet.ciiva.com/22870/70201119-22870281.pdf?src-supplier=Allied+Electronics; ComponentLink5Description: https://datasheet.ciiva.com/22870/70201119-22870281.pdf?src-supplier=Allied+Electronics; ComponentLink6URL: https://datasheet.ciiva.com/3256/dcrcwe3-3256411.pdf?src-supplier=Avnet; ComponentLink6Description: https://datasheet.ciiva.com/3256/dcrcwe3-3256411.pdf?src-supplier=Avnet; ComponentLink7URL: https://datasheet.ciiva.com/3256/dcrcwe3-3256412.pdf?src-supplier=Avnet; ComponentLink7Description: https://datasheet.ciiva.com/3256/dcrcwe3-3256412.pdf?src-supplier=Avnet; ComponentLink8URL: https://datasheet.ciiva.com/2463/dcrcwe3-2463133.pdf?src-supplier=Digi-Key; ComponentLink8Description: https://datasheet.ciiva.com/2463/dcrcwe3-2463133.pdf?src-supplier=Digi-Key; ComponentLink9URL: https://datasheet.ciiva.com/2463/dcrcwe3-2463134.pdf?src-supplier=Digi-Key; ComponentLink9Description: https://datasheet.ciiva.com/2463/dcrcwe3-2463134.pdf?src-supplier=Digi-Key; ComponentLink10URL: https://datasheet.ciiva.com/2463/dcrcwe3-2463135.pdf?src-supplier=Digi-Key; ComponentLink10Description: https://datasheet.ciiva.com/2463/dcrcwe3-2463135.pdf?src-supplier=Digi-Key; ComponentLink11URL: https://datasheet.ciiva.com/16772/70201119-16772031.pdf?src-supplier=Allied+Electronics; ComponentLink11Description: https://datasheet.ciiva.com/16772/70201119-16772031.pdf?src-supplier=Allied+Electronics; ComponentLink12URL: https://datasheet.ciiva.com/22704/1697337-22704431.pdf?src-supplier=Element14; ComponentLink12Description: https://datasheet.ciiva.com/22704/1697337-22704431.pdf?src-supplier=Element14
R28 R38 = CMP-2002-08592-1: RES SMD 3.9K OHM 1% 1/16W 0402; Manufacturer: Vishay Dale; Part Number: CRCW04023K90FKED; Voltage Rating (DC): 50V; Resistance: 3.9kR; Temperature Coefficient: 100ppm/°C; Power Rating: 63mW; Supplier 1: Digi-Key; Supplier Part Number 1: 541-3.90KLCT-ND; Manufacturer Part Number: CRCW04023K90FKED; Stock 1: 39764; Pricing 1: 1=0.10000, 10=0.03800, 100=0.01540, 1000=0.00690, 2500=0.00599, 5000=0.00495 (USD); RoHS: Yes; Case/Package: 0402; Weight: 2.3E-05oz; Case Code (Imperial): 0402; Case Code (Metric): 1005; Contact Plating: Tin; Min Operating Temperature: -55°C; Max Operating Temperature: 155°C; Tolerance: 1%; Packaging: Tape and Reel; Voltage Rating: 50V; Termination: SMD/SMT; Package Quantity: 10; Composition: Thick Film; Number of Terminations: 2; Military Standard: Not; Max Power Dissipation: 63mW; Features: Automotive AEC-Q200; Working Voltage: 50V; Length: 1mm; Height: 0.35mm; Width: 0.5mm; Depth: 0.5mm; Radiation Hardening: No; Lead Free: Lead Free; REACH SVHC: Unknown; ComponentLink1URL: https://datasheet.ciiva.com/11808/0900766b80d98824-11808689.pdf?src-supplier=RSComponents; ComponentLink1Description: https://datasheet.ciiva.com/11808/0900766b80d98824-11808689.pdf?src-supplier=RSComponents; ComponentLink2URL: https://datasheet.ciiva.com/2463/dcrcwe3-2463517.pdf?src-supplier=Digi-Key; ComponentLink2Description: https://datasheet.ciiva.com/2463/dcrcwe3-2463517.pdf?src-supplier=Digi-Key; ComponentLink3URL: https://datasheet.ciiva.com/9076/dcrcwe3-9076485.pdf?src-supplier=Avnet; ComponentLink3Description: https://datasheet.ciiva.com/9076/dcrcwe3-9076485.pdf?src-supplier=Avnet; ComponentLink4URL: https://datasheet.ciiva.com/5550/dcrcwe3-109170-5550742.pdf?src-supplier=Mouser; ComponentLink4Description: https://datasheet.ciiva.com/5550/dcrcwe3-109170-5550742.pdf?src-supplier=Mouser; ComponentLink5URL: https://datasheet.ciiva.com/22674/1847332-22674695.pdf?src-supplier=Element14; ComponentLink5Description: https://datasheet.ciiva.com/22674/1847332-22674695.pdf?src-supplier=Element14; ComponentLink6URL: https://datasheet.ciiva.com/2463/dcrcwe3-2463518.pdf?src-supplier=Digi-Key; ComponentLink6Description: https://datasheet.ciiva.com/2463/dcrcwe3-2463518.pdf?src-supplier=Digi-Key; ComponentLink7URL: https://datasheet.ciiva.com/7841/1697337-7841518.pdf?src-supplier=Element14; ComponentLink7Description: https://datasheet.ciiva.com/7841/1697337-7841518.pdf?src-supplier=Element14; ComponentLink8URL: https://datasheet.ciiva.com/2463/dcrcwe3-2463519.pdf?src-supplier=Digi-Key; ComponentLink8Description: https://datasheet.ciiva.com/2463/dcrcwe3-2463519.pdf?src-supplier=Digi-Key; ComponentLink9URL: https://datasheet.ciiva.com/16204/dcrcwe3-16204888.pdf?src-supplier=Future+Electronics; ComponentLink9Description: https://datasheet.ciiva.com/16204/dcrcwe3-16204888.pdf?src-supplier=Future+Electronics; ComponentLink10URL: https://datasheet.ciiva.com/7841/1697337-7841517.pdf?src-supplier=Element14; ComponentLink10Description: https://datasheet.ciiva.com/7841/1697337-7841517.pdf?src-supplier=Element14; ComponentLink11URL: https://datasheet.ciiva.com/26316/fld-crcw-e3-data-en-26316653.pdf?src-supplier=Distrelec; ComponentLink11Description: https://datasheet.ciiva.com/26316/fld-crcw-e3-data-en-26316653.pdf?src-supplier=Distrelec
R29 R39 = CMP-1011-00397-1: RES SMD 100 OHM 1% 1/16W 0402; Manufacturer: Vishay Dale; Manufacturer Part Number: CRCW0402100RFKED; Case-EIA: 0402; Power: 0.063 W; Case-Metric: 1005; Value: 100.00 Ohm; Resistance: 100R; Temperature Coefficient: 100ppm/°C; Power Rating: 63mW; Voltage Rating: 50V; Technology: SMT; Tolerance: 1 %; Supplier 1: Digi-Key; Supplier Part Number 1: 541-100LCT-ND; Stock 1: 503914; Pricing 1: 1=0.10000, 10=0.03800, 100=0.01540, 1000=0.00690, 2500=0.00599, 5000=0.00495 (USD); RoHS: Yes; Mount: Surface Mount; Case/Package: 0402; Weight: 2.3E-05oz; Case Code (Imperial): 0402; Case Code (Metric): 1005; Contact Plating: Tin; Min Operating Temperature: -55°C; Max Operating Temperature: 155°C; Packaging: Tape and Reel; Composition: Thick Film; Voltage Rating (DC): 50V; Number of Terminations: 2; Max Power Dissipation: 63mW; Military Standard: Not; Termination: SMD/SMT; Features: Automotive AEC-Q200; Package Quantity: 10; Working Voltage: 50V; Length: 1mm; Height: 0.35mm; Width: 0.02inch; Depth: 0.5mm; Radiation Hardening: No; REACH SVHC: Unknown; Lead Free: Lead Free; ComponentLink1URL: https://datasheet.ciiva.com/11809/0900766b80d98824-11809081.pdf?src-supplier=RSComponents; ComponentLink1Description: https://datasheet.ciiva.com/11809/0900766b80d98824-11809081.pdf?src-supplier=RSComponents; ComponentLink2URL: https://datasheet.ciiva.com/2463/dcrcwe3-2463094.pdf?src-supplier=Digi-Key; ComponentLink2Description: https://datasheet.ciiva.com/2463/dcrcwe3-2463094.pdf?src-supplier=Digi-Key; ComponentLink3URL: https://datasheet.ciiva.com/16199/dcrcwe3-16199158.pdf?src-supplier=Future+Electronics; ComponentLink3Description: https://datasheet.ciiva.com/16199/dcrcwe3-16199158.pdf?src-supplier=Future+Electronics; ComponentLink4URL: https://datasheet.ciiva.com/2463/dcrcwe3-2463095.pdf?src-supplier=Digi-Key; ComponentLink4Description: https://datasheet.ciiva.com/2463/dcrcwe3-2463095.pdf?src-supplier=Digi-Key; ComponentLink5URL: https://datasheet.ciiva.com/2463/dcrcwe3-2463096.pdf?src-supplier=Digi-Key; ComponentLink5Description: https://datasheet.ciiva.com/2463/dcrcwe3-2463096.pdf?src-supplier=Digi-Key; ComponentLink6URL: https://datasheet.ciiva.com/5552/dcrcwe3-109170-5552168.pdf?src-supplier=Mouser; ComponentLink6Description: https://datasheet.ciiva.com/5552/dcrcwe3-109170-5552168.pdf?src-supplier=Mouser; ComponentLink7URL: https://datasheet.ciiva.com/8083/dcrcwe3-8083977.pdf?src-supplier=Avnet; ComponentLink7Description: https://datasheet.ciiva.com/8083/dcrcwe3-8083977.pdf?src-supplier=Avnet; ComponentLink8URL: https://datasheet.ciiva.com/16722/70201119-16722524.pdf?src-supplier=Allied+Electronics; ComponentLink8Description: https://datasheet.ciiva.com/16722/70201119-16722524.pdf?src-supplier=Allied+Electronics; ComponentLink9URL: https://datasheet.ciiva.com/22673/1697337-22673117.pdf?src-supplier=Element14; ComponentLink9Description: https://datasheet.ciiva.com/22673/1697337-22673117.pdf?src-supplier=Element14; ComponentLink10URL: https://datasheet.ciiva.com/22673/1697337-22673118.pdf?src-supplier=Element14; ComponentLink10Description: https://datasheet.ciiva.com/22673/1697337-22673118.pdf?src-supplier=Element14; ComponentLink11URL: https://datasheet.ciiva.com/3255/dcrcwe3-3255951.pdf?src-supplier=Avnet; ComponentLink11Description: https://datasheet.ciiva.com/3255/dcrcwe3-3255951.pdf?src-supplier=Avnet
R30 R37 = CMP-2002-00221-1: RES SMD 7.5K OHM 1% 1/16W 0402; Manufacturer: Vishay Dale; Part Number: CRCW04027K50FKED; Resistance: 7.5kR; Temperature Coefficient: 100ppm/°C; Power Rating: 63mW; Voltage Rating: 50V; Supplier 1: Digi-Key; Supplier Part Number 1: 541-7.50KLCT-ND; Manufacturer Part Number: CRCW04027K50FKED; Stock 1: 225892; Pricing 1: 1=0.10000, 10=0.03800, 100=0.01540, 1000=0.00690, 2500=0.00599, 5000=0.00495 (USD); RoHS: Yes; Mount: Surface Mount; Case/Package: 0402; Weight: 2.3E-05oz; Case Code (Metric): 1005; Case Code (Imperial): 0402; Contact Plating: Tin; Min Operating Temperature: -55°C; Max Operating Temperature: 155°C; Tolerance: 1%; Packaging: Tape and Reel; Composition: Thick Film; Voltage Rating (DC): 50V; Number of Terminations: 2; Max Power Dissipation: 63mW; Package Quantity: 10000; Military Standard: Not; Termination: SMD/SMT; Features: Automotive AEC-Q200; Length: 1mm; Height: 0.35mm; Width: 0.02inch; Depth: 0.5mm; Radiation Hardening: No; Lead Free: Lead Free; REACH SVHC: Unknown; ComponentLink1URL: https://datasheet.ciiva.com/11809/0900766b80d98824-11809969.pdf?src-supplier=RSComponents; ComponentLink1Description: https://datasheet.ciiva.com/11809/0900766b80d98824-11809969.pdf?src-supplier=RSComponents; ComponentLink2URL: https://datasheet.ciiva.com/2525/dcrcwe3-2525701.pdf?src-supplier=Digi-Key; ComponentLink2Description: https://datasheet.ciiva.com/2525/dcrcwe3-2525701.pdf?src-supplier=Digi-Key; ComponentLink3URL: https://datasheet.ciiva.com/3256/dcrcwe3-3256822.pdf?src-supplier=Avnet; ComponentLink3Description: https://datasheet.ciiva.com/3256/dcrcwe3-3256822.pdf?src-supplier=Avnet; ComponentLink4URL: https://datasheet.ciiva.com/2525/dcrcwe3-2525703.pdf?src-supplier=Digi-Key; ComponentLink4Description: https://datasheet.ciiva.com/2525/dcrcwe3-2525703.pdf?src-supplier=Digi-Key; ComponentLink5URL: https://datasheet.ciiva.com/16494/dcrcwe3-16494455.pdf?src-supplier=Future+Electronics; ComponentLink5Description: https://datasheet.ciiva.com/16494/dcrcwe3-16494455.pdf?src-supplier=Future+Electronics; ComponentLink6URL: https://datasheet.ciiva.com/16885/dcrcwe3-16885719.pdf?src-supplier=Avnet+Europe; ComponentLink6Description: https://datasheet.ciiva.com/16885/dcrcwe3-16885719.pdf?src-supplier=Avnet+Europe; ComponentLink7URL: https://datasheet.ciiva.com/5549/dcrcwe3-109170-5549915.pdf?src-supplier=Mouser; ComponentLink7Description: https://datasheet.ciiva.com/5549/dcrcwe3-109170-5549915.pdf?src-supplier=Mouser; ComponentLink8URL: https://datasheet.ciiva.com/7679/1697337-7679259.pdf?src-supplier=Element14; ComponentLink8Description: https://datasheet.ciiva.com/7679/1697337-7679259.pdf?src-supplier=Element14; ComponentLink9URL: https://datasheet.ciiva.com/3256/dcrcwe3-3256821.pdf?src-supplier=Avnet; ComponentLink9Description: https://datasheet.ciiva.com/3256/dcrcwe3-3256821.pdf?src-supplier=Avnet; ComponentLink10URL: https://datasheet.ciiva.com/2525/dcrcwe3-2525702.pdf?src-supplier=Digi-Key; ComponentLink10Description: https://datasheet.ciiva.com/2525/dcrcwe3-2525702.pdf?src-supplier=Digi-Key
R33 = Trimmer: TRIMMER 5K OHM 0.25W PC PIN; Manufacturer: Vishay Foil Resistors (Division of Vishay Precision Group); Manufacturer Part Number: Y00535K00000J0L; Power (Watts): 0.25W, 1/4W; Tolerance: ±5%; Temperature Coefficient: ±10ppm/°C; Number of Turns: 21; Adjustment Type: Side Adjustment; Resistive Material: Metal Foil; Supplier 1: Digi-Key; Supplier Part Number 1: 804-1020-ND; RoHS: RoHS Compliant; Category: Potentiometers, Variable Resistors; Stock 1: 679; Pricing 1: 1=34.42, 10=32.265, 25=26.5292, 50=22.944, 100=22.227, 250=20.793, 500=19.2156 (USD); Packaging: Bulk; Part Status: Active; Mounting Type: Through Hole; Termination Style: PC Pins; Size / Dimension: Rectangular - 0.250" x 0.175" Face x 0.250" L (6.35mm x 4.45mm x 6.35mm); ComponentLink1URL: http://www.vishaypg.com/docs/63053/1240.pdf; ComponentLink1Description: http://www.vishaypg.com/docs/63053/1240.pdf
R34 R41 = CMP-2002-08314-1: RES SMD 1M OHM 1% 1/16W 0402; Manufacturer: Vishay Dale; Part Number: CRCW04021M00FKED; Resistance: 1MR; Temperature Coefficient: 100ppm/°C; Power Rating: 63mW; Voltage Rating: 50V; Supplier 1: Digi-Key; Supplier Part Number 1: 541-1.00MLCT-ND; Manufacturer Part Number: CRCW04021M00FKED; Stock 1: 126057; Pricing 1: 1=0.10000, 10=0.03800, 100=0.01540, 1000=0.00690, 2500=0.00599, 5000=0.00495 (USD); RoHS: Yes; Case/Package: 0402; Number of Pins: 2; Weight: 2.3E-05oz; Case Code (Metric): 1005; Case Code (Imperial): 0402; Contact Plating: Tin; Min Operating Temperature: -55°C; Max Operating Temperature: 155°C; Tolerance: 1%; Packaging: Tape and Reel; Composition: Thick Film; Package Quantity: 10; Number of Terminations: 2; Voltage Rating (DC): 50V; Max Power Dissipation: 63mW; Military Standard: Not; Termination: SMD/SMT; Features: Automotive AEC-Q200; Length: 1mm; Height: 0.35mm; Width: 0.02inch; Depth: 0.5mm; Radiation Hardening: No; Lead Free: Lead Free; REACH SVHC: Unknown; ComponentLink1URL: https://datasheet.ciiva.com/11809/0900766b80d98824-11809936.pdf?src-supplier=RSComponents; ComponentLink1Description: https://datasheet.ciiva.com/11809/0900766b80d98824-11809936.pdf?src-supplier=RSComponents; ComponentLink2URL: https://datasheet.ciiva.com/2463/dcrcwe3-2463361.pdf?src-supplier=Digi-Key; ComponentLink2Description: https://datasheet.ciiva.com/2463/dcrcwe3-2463361.pdf?src-supplier=Digi-Key; ComponentLink3URL: https://datasheet.ciiva.com/2463/dcrcwe3-2463362.pdf?src-supplier=Digi-Key; ComponentLink3Description: https://datasheet.ciiva.com/2463/dcrcwe3-2463362.pdf?src-supplier=Digi-Key; ComponentLink4URL: https://datasheet.ciiva.com/2463/dcrcwe3-2463363.pdf?src-supplier=Digi-Key; ComponentLink4Description: https://datasheet.ciiva.com/2463/dcrcwe3-2463363.pdf?src-supplier=Digi-Key; ComponentLink5URL: https://datasheet.ciiva.com/5548/dcrcwe3-109170-5548277.pdf?src-supplier=Mouser; ComponentLink5Description: https://datasheet.ciiva.com/5548/dcrcwe3-109170-5548277.pdf?src-supplier=Mouser; ComponentLink6URL: https://datasheet.ciiva.com/16767/70201119-16767639.pdf?src-supplier=Allied+Electronics; ComponentLink6Description: https://datasheet.ciiva.com/16767/70201119-16767639.pdf?src-supplier=Allied+Electronics; ComponentLink7URL: https://datasheet.ciiva.com/26316/fld-crcw-e3-data-en-26316602.pdf?src-supplier=Distrelec; ComponentLink7Description: https://datasheet.ciiva.com/26316/fld-crcw-e3-data-en-26316602.pdf?src-supplier=Distrelec; ComponentLink8URL: https://datasheet.ciiva.com/16211/dcrcwe3-16211596.pdf?src-supplier=Future+Electronics; ComponentLink8Description: https://datasheet.ciiva.com/16211/dcrcwe3-16211596.pdf?src-supplier=Future+Electronics; ComponentLink9URL: https://datasheet.ciiva.com/7841/1697337-7841486.pdf?src-supplier=Element14; ComponentLink9Description: https://datasheet.ciiva.com/7841/1697337-7841486.pdf?src-supplier=Element14; ComponentLink10URL: https://datasheet.ciiva.com/7841/1697337-7841806.pdf?src-supplier=Element14; ComponentLink10Description: https://datasheet.ciiva.com/7841/1697337-7841806.pdf?src-supplier=Element14; ComponentLink11URL: https://datasheet.ciiva.com/16724/70201119-16724238.pdf?src-supplier=Allied+Electronics; ComponentLink11Description: https://datasheet.ciiva.com/16724/70201119-16724238.pdf?src-supplier=Allied+Electronics; ComponentLink12URL: https://datasheet.ciiva.com/26821/getdatasheetpartid-50834-26821015.pdf?src-supplier=Verical; ComponentLink12Description: https://datasheet.ciiva.com/26821/getdatasheetpartid-50834-26821015.pdf?src-supplier=Verical; ComponentLink13URL: https://datasheet.ciiva.com/3256/dcrcwe3-3256184.pdf?src-supplier=Avnet; ComponentLink13Description: https://datasheet.ciiva.com/3256/dcrcwe3-3256184.pdf?src-supplier=Avnet; ComponentLink14URL: https://datasheet.ciiva.com/3256/dcrcwe3-3256185.pdf?src-supplier=Avnet; ComponentLink14Description: https://datasheet.ciiva.com/3256/dcrcwe3-3256185.pdf?src-supplier=Avnet
TP7-TP13 = CMP-2000-05181-1: Test Point, Black, 1-Pin THD, RoHS, Bulk; Manufacturer: Keystone; Other Names: 5001K; Catalog Drawings: 5000Series; Alternate Color: 5004K-ND / -TESTPOINTPCMINI.040"DYELLOW / 5003K-ND / -TESTPOINTPCMINI.040"DORANGE / 5002K-ND / -TESTPOINTPCMINI.040"DWHITE / 5000K-ND / -TESTPOINTPCMINI.040"DRED; Kits: DKTGRS232C-KIT-ND / -TTLCONVERTER; Online Catalog: ColorCodedTestPoints; Datasheet URL: https://ciiva.com/datasheet-click-2917627?src=ciiva&sig=bd195616; Mounting Type: 0.040"(1.02mm)HoleDiameter; Family: TestPoints; RoHS Information: RoHSComplianceStatement; Datasheet Version: Rev. G, 12/2008; Color: Black; Category: TestandMeasurement; Standard Package: 100; Manufacturer URL: http://www.keyelco.com/; Material: Base,Nylon46,UL94V-0; Type: PCTestPoint,Miniature; Terminal: 0.010"x0.020"(0.25mmx0.51mm)PhosphorBronzeWire,SilverPlated; Series: THM; Packaging: Bulk
U7 = MAX333CWP+: IC SWITCH QUAD SPDT 20TSSOP; Manufacturer: Maxim; Manufacturer Part Number: MAX333AEUP+; Max Supply Voltage: 30V; Min Supply Voltage: 10V; Min Dual Supply Voltage: 4.5V; Max Dual Supply Voltage: 20V; On-State Resistance: 35R; Operating Supply Current: 1uA; Supply Type: Single,Dual; Max Power Dissipation: 559mW; Turn-On Delay Time: 175ns; Turn-Off Delay Time: 145ns; Max Supply Current: 250uA; Number of Bits: 4; Dual Supply Voltage: 15V; Supplier 1: Mouser; Supplier Part Number 1: 700-MAX333AEUP; Stock 1: 664; Pricing 1: 1=6.77, 10=6.43, 50=5.8, 100=5.8, 1000=5.62, 10000=5.62 (USD); Case/Package: TSSOP; Number of Pins: 20; Weight: 0.006737oz; Min Operating Temperature: -40°C; Max Operating Temperature: 85°C; Packaging: Rail/Tube; Package Quantity: 74; Throw Configuration: SPDT; Number of Channels: 4; Length: 6.6mm; Height: 0.95mm; Width: 4.5mm; Radiation Hardening: No; Lead Free: Lead Free; REACH SVHC: Unknown; ComponentLink1URL: https://datasheet.ciiva.com/2978/max333a-2978850.pdf; ComponentLink1Description: https://datasheet.ciiva.com/2978/max333a-2978850.pdf; ComponentLink2URL: https://datasheet.ciiva.com/30478/0900766b81253c85-30478260.pdf; ComponentLink2Description: https://datasheet.ciiva.com/30478/0900766b81253c85-30478260.pdf; ComponentLink3URL: https://datasheet.ciiva.com/1674/max333a-1674617.pdf; ComponentLink3Description: https://datasheet.ciiva.com/1674/max333a-1674617.pdf; ComponentLink4URL: https://datasheet.ciiva.com/26825/max333aeup-26825546.pdf; ComponentLink4Description: https://datasheet.ciiva.com/26825/max333aeup-26825546.pdf
U8-U10 U12-U14 = CMP-0809-00005-2: Precision, Low Noise, Rail-to-Rail Output, Zero-Drift Operational Amplifier, 4 to 36 V, -40 to 125 degC, 5-pin SOT23 (DBV5), Green (RoHS & no Sb/Br); Manufacturer: Texas Instruments; Total Supply Voltage(Min)(+5V is 5, +/-5V is 10): 4; Offset Drift(Typ)(uV/C): 0.03; Rating: Catalog; SubFamily: Zero Drift Precision Amplifier; GBW(Typ)(MHz): 2; Slew Rate(Typ)(V/us): 0.8; Number of Channels: 1; CMRR(Min)(dB): 120; Iq per channel(Max)(mA): 0.51; Total Supply Voltage(Max)(+5V is 5, +/-5V is 10): 36; PartNumber: OPA188AIDBVR; ComponentLink2Description: Datasheet; ComponentLink2URL: http://www.ti.com/lit/ds/symlink/opa188.pdf; ComponentLink1Description: Manufacturer URL; Mounting Technology: Surface Mount; Eco-Plan: Green (RoHS & no Sb/Br); ComponentLink1URL: http://www.ti.com/; PackageVersion: 4073253-4/K, 03/2006; DatasheetVersion: SBOS642A; ComponentLink3Description: Package Specification; PackageReference: DBV0005A; ComponentLink3URL: http://www.ti.com/litv/pdf/mpds018i; PackageDescription: 5-Pin Plastic Small Outline, Body 1.6 x 2.9 mm, Pitch 0.95 mm; Code_JEDEC: MO-178
U11 = AD5231BRUZ10: Digital Potentiometer 1024POS 10KOhm Single 16-Pin TSSOP T/R; Manufacturer: Analog Devices; Resistance: 10kR; Memory Type: Non-Volatile; Number of Positions: 1024; Tolerance: 20%; Nominal Supply Current: 2.7uA; Max Supply Voltage: 5.5V; Min Supply Voltage: 2.7V; Interface: SPI; Dual Supply Voltage: 2.5V; Min Dual Supply Voltage: 2.25V; Max Dual Supply Voltage: 2.75V; Number of Circuits: 1; Temperature Coefficient: 30ppm/°C; -3db Bandwidth: 370kHz; Supplier 1: Digi-Key; Supplier Part Number 1: AD5231BRUZ10-REEL7CT-ND; Manufacturer Part Number: AD5231BRUZ10-REEL7; Stock 1: 4729; Pricing 1: 1=5.60000, 10=5.02600, 25=4.75160, 100=4.11800, 250=3.90684, 500=3.50560 (USD); RoHS: Yes; Mount: Surface Mount; Case/Package: TSSOP; Number of Pins: 16; Contact Plating: Tin,Matte; Min Operating Temperature: -40°C; Max Operating Temperature: 85°C; Package Quantity: 1; Packaging: Tape and Reel; Taper: Logarithmic; Number of Taps: 1024; Operating Supply Current: 2.7uA; Number of Elements: 1; Max Supply Current: 2.7uA; Quiescent Current: 2.7uA; Lead Free: Contains Lead; ComponentLink1URL: https://datasheet.ciiva.com/3046/ad5231-3046276.pdf?src-supplier=Avnet; ComponentLink1Description: https://datasheet.ciiva.com/3046/ad5231-3046276.pdf?src-supplier=Avnet; ComponentLink2URL: https://datasheet.ciiva.com/6666/ad5231-6666613.pdf?src-supplier=Digi-Key; ComponentLink2Description: https://datasheet.ciiva.com/6666/ad5231-6666613.pdf?src-supplier=Digi-Key; ComponentLink3URL: https://datasheet.ciiva.com/6666/ad5231-6666615.pdf?src-supplier=Digi-Key; ComponentLink3Description: https://datasheet.ciiva.com/6666/ad5231-6666615.pdf?src-supplier=Digi-Key; ComponentLink4URL: https://datasheet.ciiva.com/16593/ad5231-16593736.pdf?src-supplier=Avnet+Europe; ComponentLink4Description: https://datasheet.ciiva.com/16593/ad5231-16593736.pdf?src-supplier=Avnet+Europe